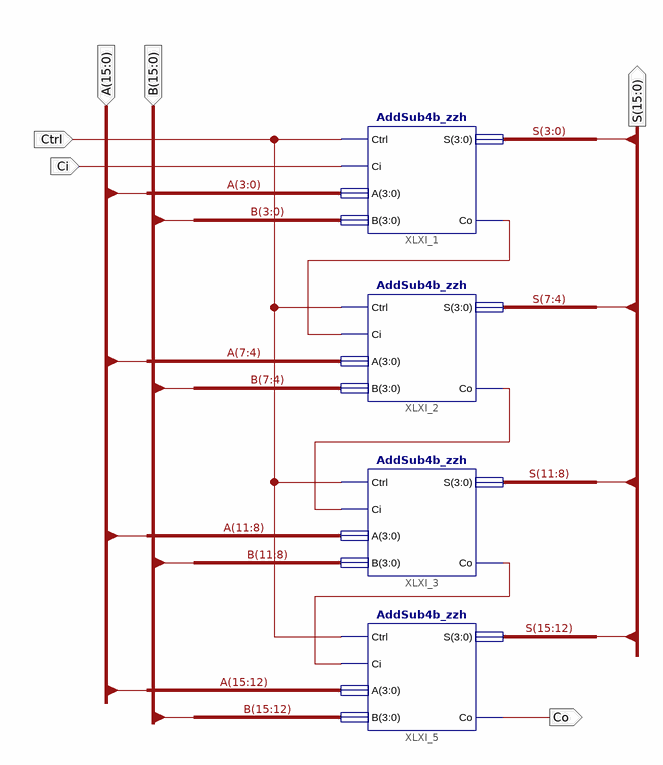
[diagram p0: schematic sheet 1]
// Xilinx ISE schematic AddSub16b_zzh.sch (kintex7) as structural Verilog: 4 symbols, 6 ports
module AddSub16b_zzh (
  input  [15:0] A,
  input  [15:0] B,
  input  Ci,
  input  Ctrl,
  output Co,
  output [15:0] S
);

  wire XLXN_1, XLXN_2, XLXN_3;

  AddSub4b_zzh XLXI_1 (.Ctrl(Ctrl), .Ci(Ci), .A(A[3:0]), .B(B[3:0]), .S(S[3:0]), .Co(XLXN_1));
  AddSub4b_zzh XLXI_2 (.Ctrl(Ctrl), .Ci(XLXN_1), .A(A[7:4]), .B(B[7:4]), .S(S[7:4]), .Co(XLXN_2));
  AddSub4b_zzh XLXI_3 (.Ctrl(Ctrl), .Ci(XLXN_2), .A(A[11:8]), .B(B[11:8]), .S(S[11:8]), .Co(XLXN_3));
  AddSub4b_zzh XLXI_5 (.Ctrl(Ctrl), .Ci(XLXN_3), .A(A[15:12]), .B(B[15:12]), .S(S[15:12]), .Co(Co));
endmodule
